# EAGLE design TurboTest (EAGLE 9.1.1)
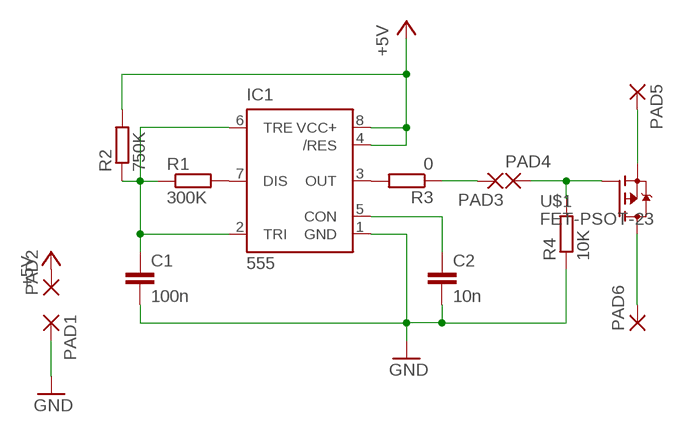
[diagram p0: schematic, sheet 1]

## Parts
C1  100n  CAP_0805  [CAP0805]
C2  10n  CAP_0805  [CAP0805]
IC1  555  IC-NE555SO8  [SOIC-8]
PAD1  WIREPAD-SMD2  [PAD-1.27X2.54]
PAD2  WIREPAD-SMD2  [PAD-1.27X2.54]
PAD3  WIREPAD-SMD2  [PAD-1.27X2.54]
PAD4  WIREPAD-SMD2  [PAD-1.27X2.54]
PAD5  WIREPAD-SMD2  [PAD-1.27X2.54]
PAD6  WIREPAD-SMD2  [PAD-1.27X2.54]
R1  300K  R_R0805  [RESC2012X50]
R2  750K  R_R0805  [RESC2012X50]
R3  0  R_R0805  [RESC2012X50]
R4  10K  R_R0805  [RESC2012X50]
U$1  FET-PSOT-23  [SOT95P240X115-3]

## Nets
+5V: IC1.4(/RES) IC1.8(VCC+) PAD2.P$1(P) R2.2
GND: C1.2 C2.2 IC1.1(GND) PAD1.P$1(P) R4.1
N$1: IC1.7(DIS) R1.2
N$2: C1.1 IC1.2(TRI) IC1.6(TRE) R1.1 R2.1
N$3: C2.1 IC1.5(CON)
N$4: IC1.3(OUT) R3.2
N$5: PAD3.P$1(P) R3.1
N$6: PAD4.P$1(P) R4.2 U$1.1(G)
N$7: PAD5.P$1(P) U$1.2(S)
N$8: PAD6.P$1(P) U$1.3(D)

## Library data of the parts
C1 C2 = Flamberm:CAP_
IC1 = Flamberm:IC-NE555
PAD1-PAD6 = Flamberm:WIREPAD-SMD2: SMD PAD
R1-R4 = Flamberm:R_
U$1 = Flamberm:FET-P

## Board
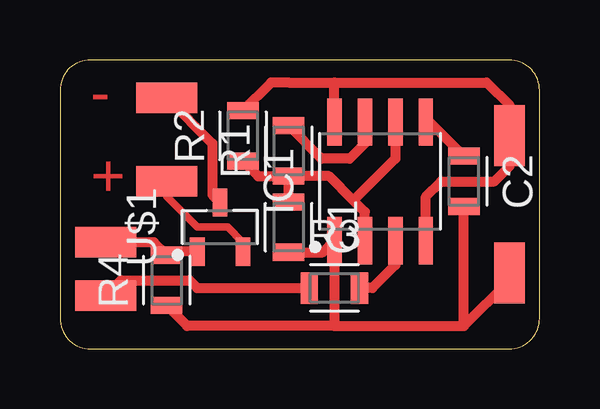
[diagram p1: board, top side]

Size 19.98 x 12.05 mm. Coordinates in mm from the lower left corner, seen from the top.
Outline: 0,10.78 0,1.27 arc90 1.27,0 18.71,0 arc90 19.98,1.27 19.98,10.78 arc90 18.71,12.05 1.27,12.05 arc90 0,10.78
Copper layers (1*16): Top 0.035mm / dielectric 1.5mm / Bottom 0.035mm
Design rules "EagleDesignRules *": minimum track width 0.25mm, minimum drill 0.3mm, track to track 0.2mm, track to pad 0.25mm, pad to pad 0.25mm, via to via 0.25mm, smd to smd 0.25mm, copper to edge 0.5mm, drill to drill 0.5mm, minimum pad ring 10mil, minimum via ring 8mil, stop-mask expansion 4mil, vias tented up to drill 0mil, thermal gap 0.25mm

### Footprints (pad centres in the part's own frame; a part is rotated, then mirrored left to right if it is on the bottom)
CAP0805 = smd 0.712 x 1.312: 1 -1.05,0; 2 1.05,0
SOIC-8 = smd 1.968 x 0.602: 1 -2.473,1.905; 2 -2.473,0.635; 3 -2.473,-0.635; 4 -2.473,-1.905; 5 2.473,-1.905; 6 2.473,-0.635; 7 2.473,0.635; 8 2.473,1.905
PAD-1.27X2.54 = smd 2.54 x 1.27: P$1 0,0
RESC2012X50 = smd 0.712 x 1.312: 1 -1.05,0; 2 1.05,0
SOT95P240X115-3 = smd 1.18 x 0.609: 1 -1.024,0.95; 2 -1.024,-0.95; 3 1.024,0

### Placement (x,y rotation side)
C1  9.53,5.08 270 top
C2  16.83,6.99 270 top
IC1  13.34,6.99 90 top
PAD1  18.73,3.17 90 top
PAD2  18.73,8.89 90 top
PAD3  1.91,2.22 180 top
PAD4  1.91,4.45 0 top
PAD5  4.45,6.99 180 top
PAD6  4.45,10.48 180 top
R1  9.53,8.25 90 top
R2  7.62,8.89 90 top
R3  11.43,2.54 0 top
R4  4.45,2.86 90 top
U$1  6.67,5.08 90 top

### Tracks (layer width: path | path; a pad name or v marks a point on that pad's centre or on a via)
+5V
  Top 0.406: 11.43,11.11 9.52,11.11 8.79,11.11 R2.2 | 11.43,11.11 17.78,11.11 18.73,10.16 PAD2.P$1 18.73,7.62 18.1,6.99 15.88,6.99 15.24,6.35 IC1.4 | IC1.8 11.43,11.11
GND
  Top 0.406: 16.83,0.95 C2.2 | 11.43,0.95 IC1.1 10.95,4.03 C1.2 | 11.43,0.95 5.3,0.95 R4.1 | 11.43,0.95 16.83,0.95 | 16.83,0.95 18.73,2.86 PAD1.P$1
N$1
  Top 0.406: IC1.7 12.7,8.57 12.07,7.94 10.89,7.94 R1.2
N$2
  Top 0.406: R2.1 8.26,7.21 R1.1 | IC1.2 12.7,5.71 12.22,6.19 | R1.1 11.21,7.21 12.22,6.19 | IC1.6 13.97,7.94 12.22,6.19 | C1.1 R1.1
N$3
  Top 0.406: IC1.5 15.4,9.46 C2.1
N$4
  Top 0.406: IC1.3 13.97,3.49 13.02,2.54 R3.2
N$5
  Top 0.406: PAD3.P$1 2.54,2.86 5.4,2.86 5.71,2.54 R3.1
N$6
  Top 0.406: U$1.1 4.59,4.06 R4.2 3.91,4.45 PAD4.P$1
N$7
  Top 0.305: PAD5.P$1 4.44,6.35 5.71,5.08 6.98,5.08 7.62,4.45 7.62,4.44 U$1.2
  Top 0.406: PAD5.P$1 4.44,6.67
N$8
  Top 0.406: PAD6.P$1 6.35,8.57 6.35,6.42 U$1.3

### Text on the board
Top: - | +